# EAGLE schematic mega_classboard2.1 (EAGLE 6.5.0)
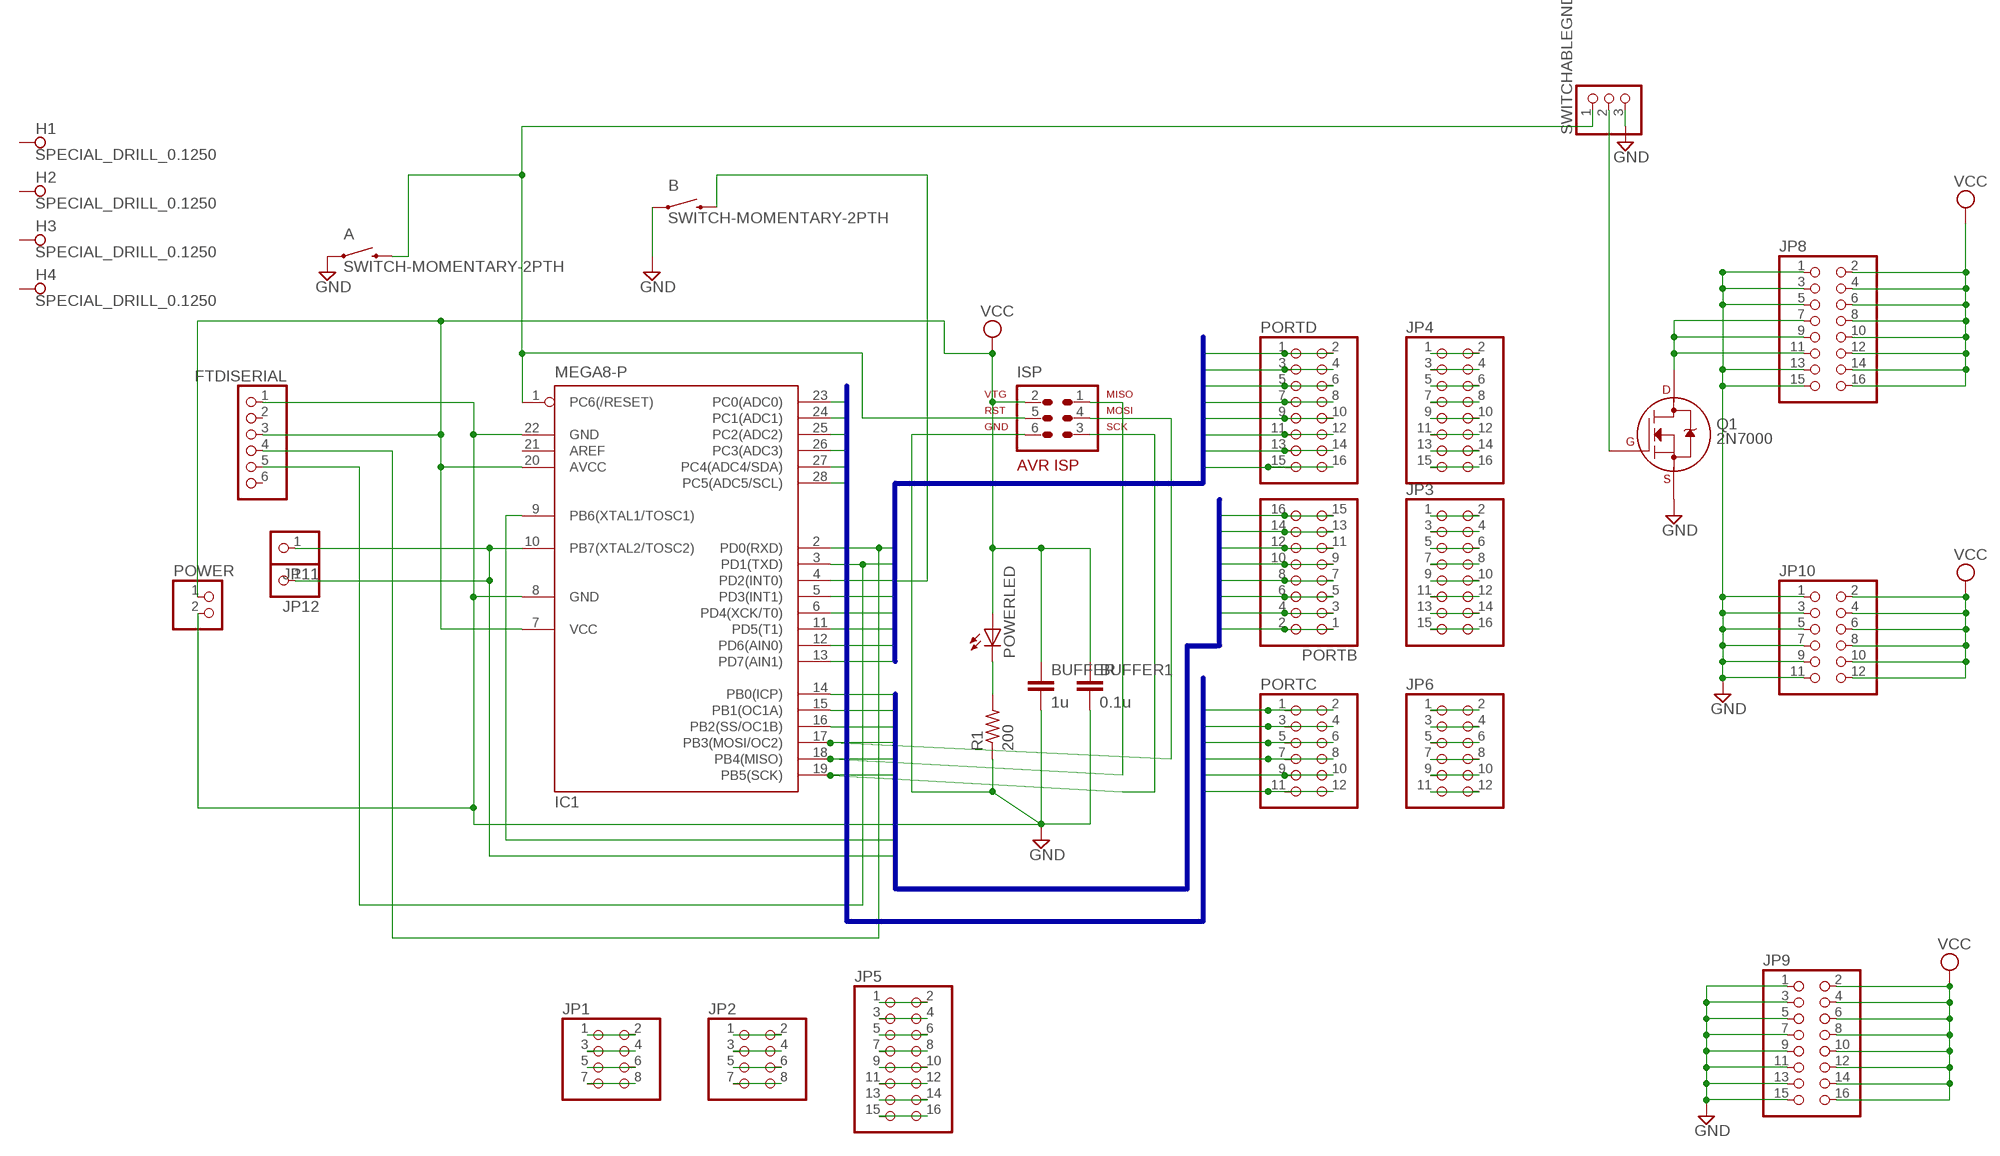
[diagram p0: schematic, sheet 1]

## Parts
A  SWITCH-MOMENTARY-2PTH  [TACTILE-PTH]
B  SWITCH-MOMENTARY-2PTH  [TACTILE-PTH]
BUFFER  1u  C5/3.5  [C5B3.5]
BUFFER1  0.1u  C5/3.5  [C5B3.5]
FTDISERIAL  PINHD-1X6  [1X06]
H1  SPECIAL_DRILL_0.1250  [PAD_0.1250]
H2  SPECIAL_DRILL_0.1250  [PAD_0.1250]
H3  SPECIAL_DRILL_0.1250  [PAD_0.1250]
H4  SPECIAL_DRILL_0.1250  [PAD_0.1250]
IC1  MEGA8-P  [DIL28-3]
ISP  AVR-ISP-6  [AVR-ISP-6]
JP1  PINHD-2X4  [2X04]
JP2  PINHD-2X4  [2X04]
JP3  PINHD-2X8  [2X08]
JP4  PINHD-2X8  [2X08]
JP5  PINHD-2X8  [2X08]
JP6  PINHD-2X6  [2X06]
JP8  PINHD-2X8  [2X08]
JP9  PINHD-2X8  [2X08]
JP10  PINHD-2X6  [2X06]
JP11  PINHD-1X1  [1X01]
JP12  PINHD-1X1  [1X01]
PORTB  PINHD-2X8  [2X08]
PORTC  PINHD-2X6  [2X06]
PORTD  PINHD-2X8  [2X08]
POWER  PINHD-1X2  [1X02]
POWERLED  LED5MM  [LED5MM]
Q1  2N7000  2N7000_TO92  [TO-92]
R1  200  R-US_0204/7  [0204/7]
SWITCHABLEGND  PINHD-1X3  [1X03]

## Nets
GND: A.1 B.1 BUFFER1.2 BUFFER.2 FTDISERIAL.1 IC1.8(GND) IC1.22(GND) ISP.6 JP8.1 JP8.3 JP8.5 JP8.13 JP8.15 JP9.1 JP9.3 JP9.5 JP9.7 JP9.9 JP9.11 JP9.13 JP9.15 JP10.1 JP10.3 JP10.5 JP10.7 JP10.9 JP10.11 POWER.2 Q1.1(S) R1.1 SWITCHABLEGND.3
N$1: POWERLED.K(C) R1.2
N$2: Q1.2(G) SWITCHABLEGND.2
N$3: JP6.11 JP6.12
N$4: JP6.9 JP6.10
N$5: JP6.7 JP6.8
N$6: JP6.5 JP6.6
N$7: JP6.3 JP6.4
N$8: JP6.1 JP6.2
N$9: JP3.15 JP3.16
N$10: JP3.13 JP3.14
N$11: JP3.11 JP3.12
N$12: JP3.9 JP3.10
N$13: JP3.7 JP3.8
N$14: JP3.5 JP3.6
N$15: JP3.3 JP3.4
N$16: JP3.1 JP3.2
N$17: JP4.15 JP4.16
N$18: JP4.13 JP4.14
N$19: JP4.11 JP4.12
N$20: JP4.9 JP4.10
N$21: JP4.7 JP4.8
N$22: JP4.5 JP4.6
N$23: JP4.3 JP4.4
N$24: JP4.1 JP4.2
N$25: JP1.1 JP1.2
N$26: JP1.3 JP1.4
N$27: JP1.5 JP1.6
N$28: JP1.7 JP1.8
N$29: JP2.1 JP2.2
N$30: JP2.3 JP2.4
N$31: JP2.5 JP2.6
N$32: JP2.7 JP2.8
N$33: JP5.1 JP5.2
N$34: JP5.3 JP5.4
N$35: JP5.5 JP5.6
N$36: JP5.7 JP5.8
N$37: JP5.9 JP5.10
N$38: JP5.11 JP5.12
N$39: JP5.13 JP5.14
N$40: JP5.15 JP5.16
N$41: JP8.7 JP8.9 JP8.11 Q1.3(D)
N$46: A.3 IC1.1(PC6(/RESET)) ISP.5 SWITCHABLEGND.1
PORTB0: IC1.14(PB0(ICP)) PORTB.1 PORTB.2
PORTB1: IC1.15(PB1(OC1A)) PORTB.3 PORTB.4
PORTB2: IC1.16(PB2(SS/OC1B)) PORTB.5 PORTB.6
PORTB3: IC1.17(PB3(MOSI/OC2)) ISP.4 PORTB.7 PORTB.8
PORTB4: IC1.18(PB4(MISO)) ISP.1 PORTB.9 PORTB.10
PORTB5: IC1.19(PB5(SCK)) ISP.3 PORTB.11 PORTB.12
PORTB6: IC1.9(PB6(XTAL1/TOSC1)) PORTB.13 PORTB.14
PORTB7: IC1.10(PB7(XTAL2/TOSC2)) JP11.1 JP12.1 PORTB.15 PORTB.16
PORTC0: IC1.23(PC0(ADC0)) PORTC.1 PORTC.2
PORTC1: IC1.24(PC1(ADC1)) PORTC.3 PORTC.4
PORTC2: IC1.25(PC2(ADC2)) PORTC.5 PORTC.6
PORTC3: IC1.26(PC3(ADC3)) PORTC.7 PORTC.8
PORTC4: IC1.27(PC4(ADC4/SDA)) PORTC.9 PORTC.10
PORTC5: IC1.28(PC5(ADC5/SCL)) PORTC.11 PORTC.12
PORTD0: FTDISERIAL.4 IC1.2(PD0(RXD)) PORTD.1 PORTD.2
PORTD1: FTDISERIAL.5 IC1.3(PD1(TXD)) PORTD.3 PORTD.4
PORTD2: B.3 IC1.4(PD2(INT0)) PORTD.5 PORTD.6
PORTD3: IC1.5(PD3(INT1)) PORTD.7 PORTD.8
PORTD4: IC1.6(PD4(XCK/T0)) PORTD.9 PORTD.10
PORTD5: IC1.11(PD5(T1)) PORTD.11 PORTD.12
PORTD6: IC1.12(PD6(AIN0)) PORTD.13 PORTD.14
PORTD7: IC1.13(PD7(AIN1)) PORTD.15 PORTD.16
VCC: BUFFER1.1 BUFFER.1 FTDISERIAL.3 IC1.7(VCC) IC1.20(AVCC) ISP.2 JP8.2 JP8.4 JP8.6 JP8.8 JP8.10 JP8.12 JP8.14 JP8.16 JP9.2 JP9.4 JP9.6 JP9.8 JP9.10 JP9.12 JP9.14 JP9.16 JP10.2 JP10.4 JP10.6 JP10.8 JP10.10 JP10.12 POWER.1 POWERLED.A
Unconnected: FTDISERIAL.2 FTDISERIAL.6 H1.1 H2.1 H3.1 H4.1 IC1.21(AREF)

## Buses
PORTD[0..7]
PORTB[0..7]
PORTC[0..5]

## Library data of the parts
A B = SparkFun:SWITCH-MOMENTARY-2
BUFFER BUFFER1 = capacitor-wima:C: CAPACITOR naming: grid - package width
FTDISERIAL = pinhead:PINHD-1X6: PIN HEADER
H1-H4 = special-drill:SPECIAL_DRILL_: Special drills
IC1 = atmel:MEGA8-P: MICROCONTROLLER 8 Kbytes FLASH, 1 kbytes SRAM, 512 bytes EEPROM, USART, 4-channel 10 bit ADC, 2-channel 8 bit ADC Pin compatible with Atmega48, ATMega88, ATMega168 Source: avr.lbr; OC_FARNELL: unknown; OC_NEWARK: unknown
ISP = atmel-1:AVR-ISP-6: AVR ISP-6 Serial Programming Header
JP1 JP2 = pinhead:PINHD-2X4: PIN HEADER
JP3-JP5 JP8 JP9 PORTB PORTD = pinhead:PINHD-2X8: PIN HEADER
JP6 JP10 PORTC = pinhead:PINHD-2X6: PIN HEADER
JP11 JP12 = pinhead:PINHD-1X1: PIN HEADER
POWER = pinhead:PINHD-1X2: PIN HEADER
POWERLED = led:LED: LED OSRAM: - CHIPLED LG R971, LG N971, LY N971, LG Q971, LY Q971, LO R971, LY R971 LH N974, LH R974 LS Q976, LO Q976, LY Q976 LO Q996 - Hyper CHIPLED LW Q18S LB Q993, LB Q99A, LB R99A - SideLED LS A670, LO A670, LY A670, LG A670, LP A670 LB A673, LV A673, LT A673, LW A673 LH A674 LY A675 LS A676, LA A676, LO A676, LY A676, LW A676 LS A679, LY A679, LG A679 - Hyper Micro SIDELED® LS Y876, LA Y876, LO Y876, LY Y876 LT Y87S - SmartLED LW L88C, LW L88S LB L89C, LB L89S, LG L890 LS L89K, LO L89K, LY L89K LS L896, LA L896, LO L896, LY L896 - TOPLED LS T670, LO T670, LY T670, LG T670, LP T670 LSG T670, LSP T670, LSY T670, LOP T670, LYG T670 LG T671, LOG T671, LSG T671 LB T673, LV T673, LT T673, LW T673 LH T674 LS T676, LA T676, LO T676, LY T676, LB T676, LH T676, LSB T676, LW T676 LB T67C, LV T67C, LT T67C, LS T67K, LO T67K, LY T67K, LW E67C LS E67B, LA E67B, LO E67B, LY E67B, LB E67C, LV E67C, LT E67C LW T67C LS T679, LY T679, LG T679 LS T770, LO T770, LY T770, LG T770, LP T770 LB T773, LV T773, LT T773, LW T773 LH T774 LS E675, LA E675, LY E675, LS T675 LS T776, LA T776, LO T776, LY T776, LB T776 LHGB T686 LT T68C, LB T68C - Hyper Mini TOPLED® LB M676 - Mini TOPLED Santana® LG M470 LS M47K, LO M47K, LY M47K Source: http://www.osram.convergy.de LUXEON: - LUMILED® LXK2-PW12-R00, LXK2-PW12-S00, LXK2-PW14-U00, LXK2-PW14-V00 LXK2-PM12-R00, LXK2-PM12-S00, LXK2-PM14-U00 LXK2-PE12-Q00, LXK2-PE12-R00, LXK2-PE12-S00, LXK2-PE14-T00, LXK2-PE14-U00 LXK2-PB12-K00, LXK2-PB12-L00, LXK2-PB12-M00, LXK2-PB14-N00, LXK2-PB14-P00, LXK2-PB14-Q00 LXK2-PR12-L00, LXK2-PR12-M00, LXK2-PR14-Q00, LXK2-PR14-R00 LXK2-PD12-Q00, LXK2-PD12-R00, LXK2-PD12-S00 LXK2-PH12-R00, LXK2-PH12-S00 LXK2-PL12-P00, LXK2-PL12-Q00, LXK2-PL12-R00 Source: www.luxeon.com KINGBRIGHT: KA-3528ASYC Source: www.kingbright.com
Q1 = transistors:2N700*: 2N7000, 2N7002, NDS7002A N-channel enhancement mode MOSFET
R1 = rcl:R-US_: RESISTOR, American symbol
SWITCHABLEGND = pinhead:PINHD-1X3: PIN HEADER